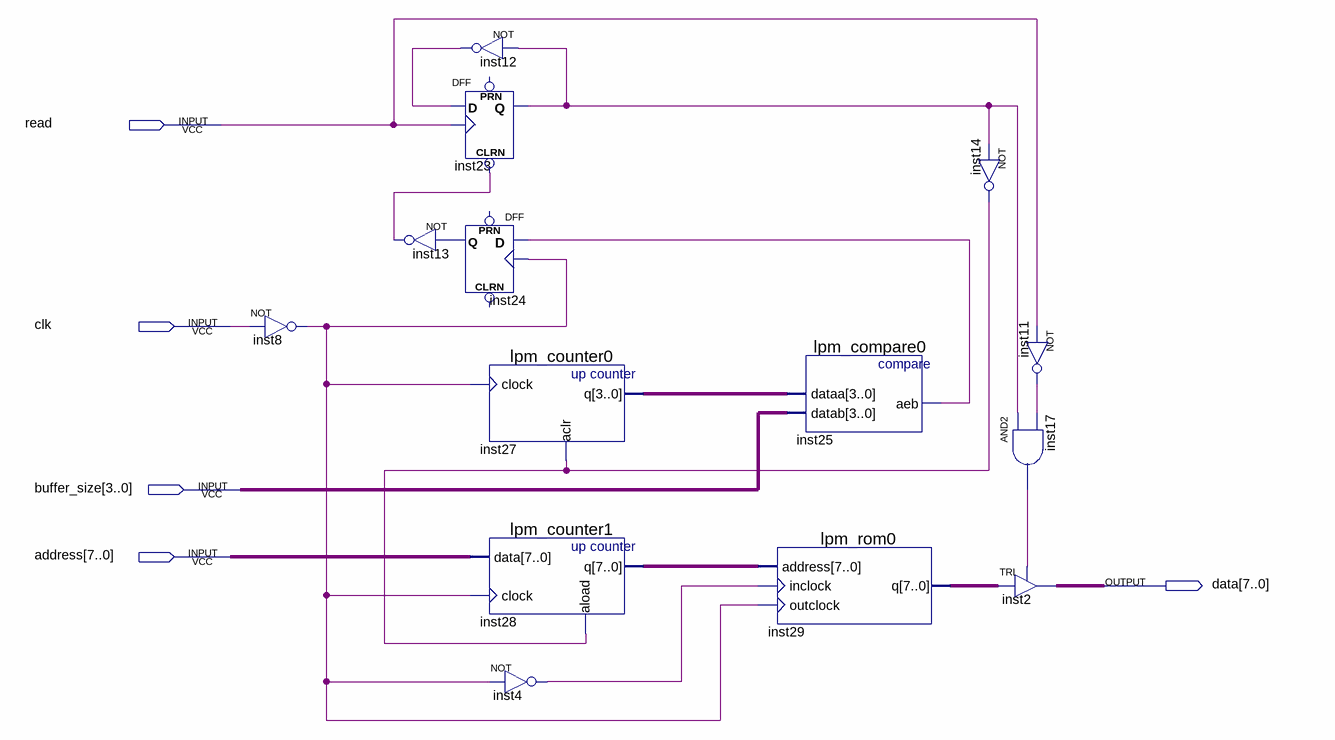
[diagram p0: schematic sheet]
// Quartus schematic ROM.bdf as structural Verilog: 14 symbols, 5 pins
module ROM (
  input  read,
  input  clk,
  input  [3:0] buffer_size,
  input  [7:0] address,
  output [7:0] data
);

  wire inst4_out, inst8_out, inst11_out, inst12_out, inst13_out, inst14_out, inst17_out, inst23_q, inst24_q,
       inst25_aeb;
  wire [3:0] inst27_q;
  wire [7:0] inst28_q, inst29_q;

  not inst8 (inst8_out, clk);
  DFF inst23 (.CLRN(inst13_out), .CLK(read), .D(inst12_out), .Q(inst23_q));  // open: PRN
  DFF inst24 (.CLK(inst8_out), .D(inst25_aeb), .Q(inst24_q));  // open: CLRN, PRN
  not inst13 (inst13_out, inst24_q);
  not inst12 (inst12_out, inst23_q);
  lpm_counter0 inst27 (.clock(inst8_out), .aclr(inst14_out), .q(inst27_q));
  lpm_counter1 inst28 (.data(address), .clock(inst8_out), .aload(inst14_out), .q(inst28_q));
  not inst4 (inst4_out, inst8_out);
  lpm_rom0 inst29 (.address(inst28_q), .inclock(inst4_out), .outclock(inst8_out), .q(inst29_q));
  lpm_compare0 inst25 (.dataa(inst27_q), .datab(buffer_size), .aeb(inst25_aeb));
  not inst14 (inst14_out, inst23_q);
  not inst11 (inst11_out, read);
  and inst17 (inst17_out, inst23_q, inst11_out);
  TRI inst2[7:0] (.IN(inst29_q), .OE(inst17_out), .OUT(data));
endmodule
